# EAGLE design untitled (EAGLE 7.3.0)
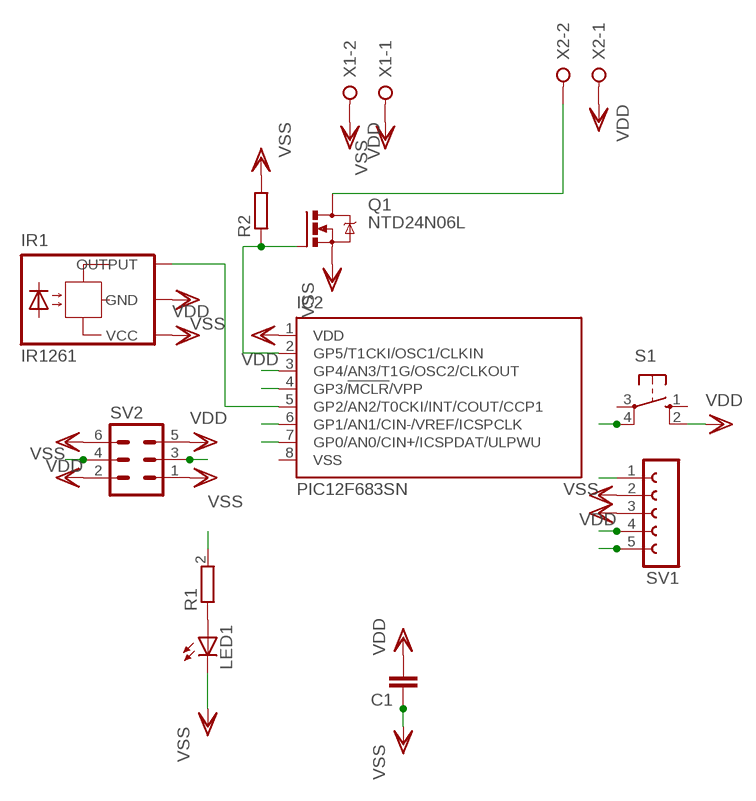
[diagram p0: schematic, sheet 1]

## Parts
C1  C-EUC0805  [C0805]
IC2  PIC12F683SN  [SO-08]
IR1  IR1261  [IR1261]
LED1  LEDCHIP-LED0603  [CHIP-LED0603]
Q1  NTD24N06L  [D-PAK_TO252AA]
R1  R0805_SMALL  [R0805_SMALL]
R2  R-EU_R0805  [R0805]
S1  10-XX  [B3F-10XX]
SV1  FE05-1  [FE05-1]
SV2  MA03-2  [MA03-2]
X1  W237-02P  [W237-132]
X2  W237-02P  [W237-132]

## Nets
MCLR: IC2.4(GP3/!MCLR!/VPP) SV1.1 SV2.4
N$1: IC2.5(GP2/AN2/T0CKI/INT/COUT/CCP1) IR1.VO(OUTPUT)
N$2: LED1.A R1.1(A)
N$3: IC2.2(GP5/T1CKI/OSC1/CLKIN) Q1.1(G) R2.1
N$5: Q1.4(D) X2.2
PGC: IC2.6(GP1/AN1/CIN-/VREF/ICSPCLK) R1.2(B) SV1.5
PGD: IC2.7(GP0/AN0/CIN+/ICSPDAT/ULPWU) SV1.4 SV2.3
S1: IC2.3(GP4/AN3/T1G/OSC2/CLKOUT) S1.4(P1)
VDD: C1.2 IC2.1(VDD) IR1.VCC S1.2(S1) SV1.2 SV2.5 SV2.6 X1.2 X2.1
VSS: C1.1 IR1.GND LED1.C Q1.3(S) R2.2 SV1.3 SV2.1 SV2.2 X1.1
Unconnected: S1.1(S) S1.3(P)

## Power pins joined to a net without a drawn wire
VSS: IC2.8(VSS)

## Library data of the parts
C1 = rcl:C-EU: CAPACITOR, European symbol
IC2 = microchip:PIC12F683: 8-Pin Flash-Based, 8-Bit CMOS Microcontrollers with nanoWatt Technology Source: http://ww1.microchip.com/downloads/en/DeviceDoc/41211D_.pdf; MF: MICROCHIP; MPN: PIC12F683-I/SN; OC_FARNELL: 9759042; OC_NEWARK: 61K3434
IR1 = manuel:IR1261
LED1 = led:LED: LED OSRAM: - CHIPLED LG R971, LG N971, LY N971, LG Q971, LY Q971, LO R971, LY R971 LH N974, LH R974 LS Q976, LO Q976, LY Q976 LO Q996 - Hyper CHIPLED LW Q18S LB Q993, LB Q99A, LB R99A - SideLED LS A670, LO A670, LY A670, LG A670, LP A670 LB A673, LV A673, LT A673, LW A673 LH A674 LY A675 LS A676, LA A676, LO A676, LY A676, LW A676 LS A679, LY A679, LG A679 - Hyper Micro SIDELED® LS Y876, LA Y876, LO Y876, LY Y876 LT Y87S - SmartLED LW L88C, LW L88S LB L89C, LB L89S, LG L890 LS L89K, LO L89K, LY L89K LS L896, LA L896, LO L896, LY L896 - TOPLED LS T670, LO T670, LY T670, LG T670, LP T670 LSG T670, LSP T670, LSY T670, LOP T670, LYG T670 LG T671, LOG T671, LSG T671 LB T673, LV T673, LT T673, LW T673 LH T674 LS T676, LA T676, LO T676, LY T676, LB T676, LH T676, LSB T676, LW T676 LB T67C, LV T67C, LT T67C, LS T67K, LO T67K, LY T67K, LW E67C LS E67B, LA E67B, LO E67B, LY E67B, LB E67C, LV E67C, LT E67C LW T67C LS T679, LY T679, LG T679 LS T770, LO T770, LY T770, LG T770, LP T770 LB T773, LV T773, LT T773, LW T773 LH T774 LS E675, LA E675, LY E675, LS T675 LS T776, LA T776, LO T776, LY T776, LB T776 LHGB T686 LT T68C, LB T68C - Hyper Mini TOPLED® LB M676 - Mini TOPLED Santana® LG M470 LS M47K, LO M47K, LY M47K Source: http://www.osram.convergy.de LUXEON: - LUMILED® LXK2-PW12-R00, LXK2-PW12-S00, LXK2-PW14-U00, LXK2-PW14-V00 LXK2-PM12-R00, LXK2-PM12-S00, LXK2-PM14-U00 LXK2-PE12-Q00, LXK2-PE12-R00, LXK2-PE12-S00, LXK2-PE14-T00, LXK2-PE14-U00 LXK2-PB12-K00, LXK2-PB12-L00, LXK2-PB12-M00, LXK2-PB14-N00, LXK2-PB14-P00, LXK2-PB14-Q00 LXK2-PR12-L00, LXK2-PR12-M00, LXK2-PR14-Q00, LXK2-PR14-R00 LXK2-PD12-Q00, LXK2-PD12-R00, LXK2-PD12-S00 LXK2-PH12-R00, LXK2-PH12-S00 LXK2-PL12-P00, LXK2-PL12-Q00, LXK2-PL12-R00 Source: www.luxeon.com KINGBRIGHT: KA-3528ASYC Source: www.kingbright.com
Q1 = manuel:NTD24N06L: N-Channel HEXFET® Power MOSFET Logic Level
R1 = manuel:R0805_SMALL
R2 = rcl:R-EU_: RESISTOR, European symbol
S1 = switch-omron:10-XX: OMRON SWITCH; MPN: B3F-1000; OC_FARNELL: 176432; OC_NEWARK: 36M3542
SV1 = con-lsta:FE05-1: FEMALE HEADER; OC_FARNELL: unknown; OC_NEWARK: unknown
SV2 = con-lstb:MA03-2: PIN HEADER; OC_FARNELL: unknown; OC_NEWARK: unknown
X1 X2 = con-wago-508:W237-02P: WAGO SREW CLAMP; OC_FARNELL: unknown; OC_NEWARK: unknown

## Board
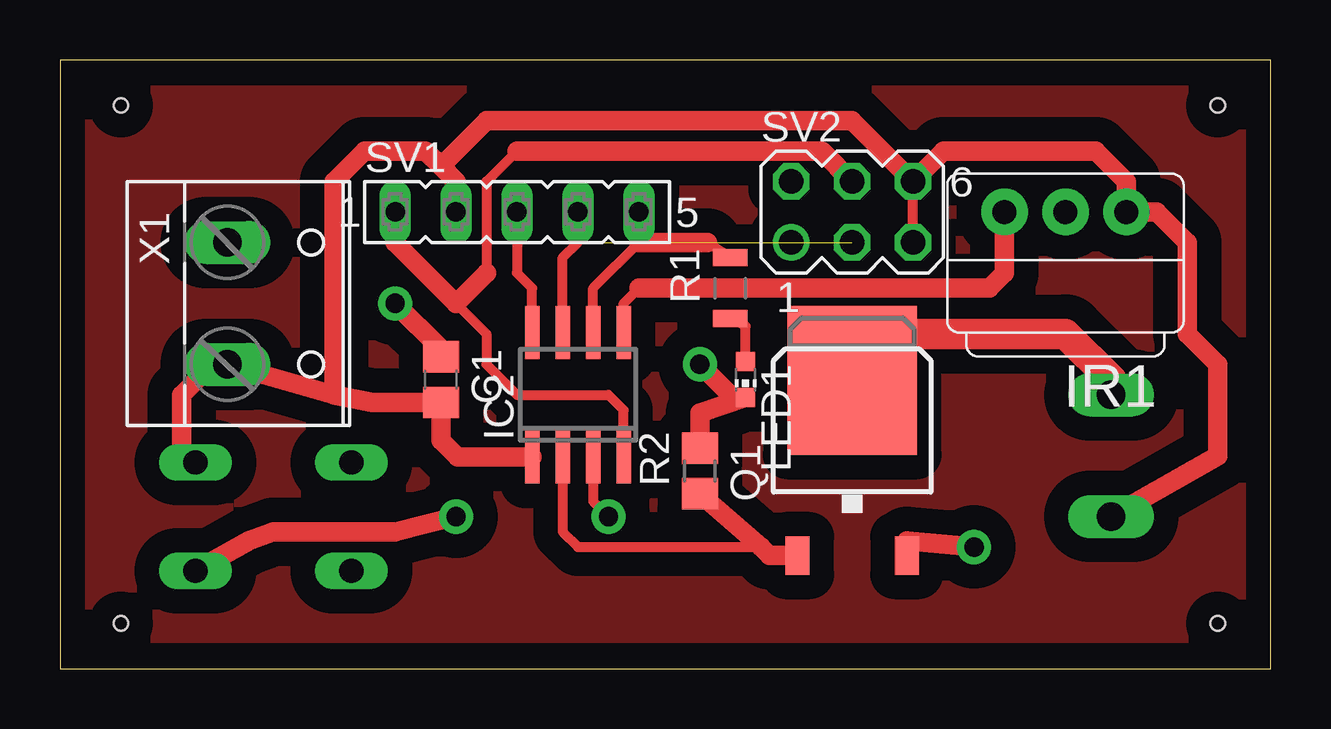
[diagram p1: board, top side]
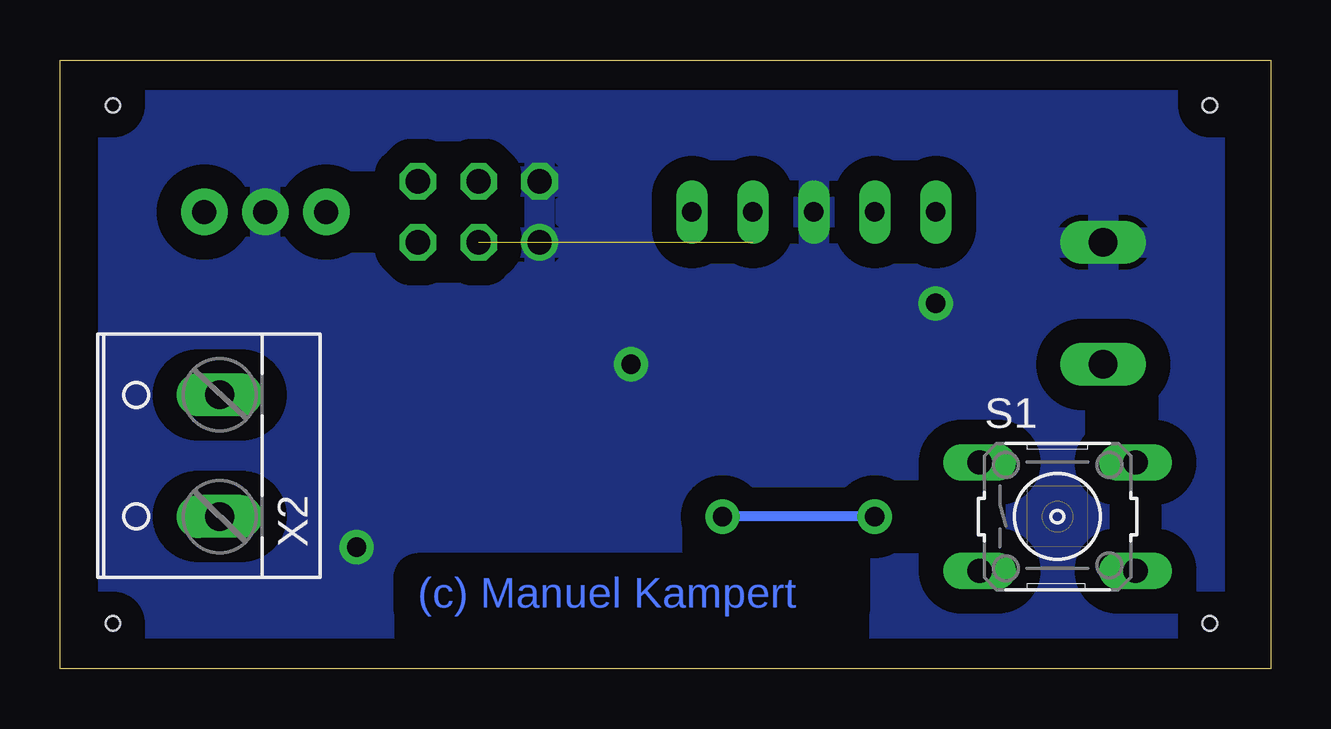
[diagram p2: board, bottom side, seen from below]

Size 50.47 x 25.39 mm. Coordinates in mm from the lower left corner, seen from the top.
Outline: 0,0 50.47,0 50.47,25.39 0,25.39 0,0
Copper layers (1*16): Top 0.035mm / dielectric 1.5mm / Bottom 0.035mm
Design rules "default": minimum track width 10mil, minimum drill 24mil, track to track 8mil, track to pad 8mil, pad to pad 8mil, via to via 8mil, smd to smd 8mil, copper to edge 40mil, drill to drill 8mil, minimum pad ring 10mil, minimum via ring 8mil, stop-mask expansion 4mil, vias tented up to drill 0mil, thermal gap 10mil
Holes 0.6 mm at 2.54,23.5 48.26,23.5 48.26,1.9 2.54,1.9

### Footprints (pad centres in the part's own frame; a part is rotated, then mirrored left to right if it is on the bottom)
C0805 = smd 1.3 x 1.5: 1 -0.95,0; 2 0.95,0
SO-08 = smd 0.6 x 2.2: 1 -1.905,-2.6; 2 -0.635,-2.6; 3 0.635,-2.6; 4 1.905,-2.6; 5 1.905,2.6; 6 0.635,2.6; 7 -0.635,2.6; 8 -1.905,2.6
IR1261 = drill 1 pad 1.93: GND 0,-1.27; VCC 0,-3.81; VO 0,1.27
CHIP-LED0603 = smd 0.8 x 0.8: A 0,-0.75; C 0,0.75
D-PAK_TO252AA = smd 1 x 1.6: 1 -2.28,-4.8; 3 2.28,-4.8 | smd 5.4 x 6.2: 4 0,2.5
R0805_SMALL = smd 0.711 x 1.422: 1 -1.27,0; 2 1.27,0
R0805 = smd 1.3 x 1.5: 1 -0.95,0; 2 0.95,0
B3F-10XX = drill 1.016 long: 1 -3.251,2.261; 2 3.251,2.261; 3 -3.251,-2.261; 4 3.251,-2.261
FE05-1 = drill 0.813 long: 1 -5.08,0; 2 -2.54,0; 3 0,0; 4 2.54,0; 5 5.08,0
MA03-2 = drill 1.016: 1 -2.54,-1.27 | drill 1.016 octagon: 2 -2.54,1.27; 3 0,-1.27; 4 0,1.27; 5 2.54,-1.27; 6 2.54,1.27
W237-132 = drill 1.194 long: 1 -2.54,-0.635; 2 2.54,-0.635

### Placement (x,y rotation side)
C1  15.88,12.06 270 top
IC2  21.59,11.43 0 top
IR1  40.64,19.05 90 top
LED1  28.57,12.06 180 top
Q1  33.02,9.53 0 top
R1  27.94,15.87 90 top
R2  26.67,8.25 90 top
S1  8.89,6.35 0 bottom
SV1  19.05,19.05 0 top
SV2  33.02,19.05 0 top
X1  7.62,15.24 270 top
X2  44.45,8.89 90 bottom

### Tracks (layer width: path | path; a pad name or v marks a point on that pad's centre or on a via)
MCLR
  Top 0.406: 16.51,15.24 17.78,13.97 17.78,12.7 19.05,11.43 22.86,11.43 23.5,10.79 IC2.4 | 19.05,21.59 17.78,20.32 17.78,16.51
  Top 0.813: SV1.1 13.97,17.78 16.51,15.24 17.78,16.51 | SV2.4 31.75,21.59 19.05,21.59
N$1
  Top 0.406: IC2.5 23.5,15.24 24.13,15.87
  Top 0.813: 24.13,15.87 38.73,15.87 39.37,16.51 IR1.VO
N$2
  Top 0.406: LED1.A 28.57,14.29 R1.1
N$3
  Top 0.406: IC2.2 20.95,5.71 21.59,5.08 29.21,5.08
  Top 0.813: Q1.1 29.57,4.72 29.21,5.08 R2.1
N$4
  pour Top (isolate 1.016): 2.54,24.13 49.53,24.13 49.53,1.27 1.27,1.27 1.27,24.13
N$5
  Top 1.27: Q1.4 34.29,12.7 35.56,13.97 41.91,13.97 43.81,12.06 X2.2
PGC
  Top 0.406: IC2.6 22.23,15.87 24.13,17.78 SV1.5 | 26.98,17.78 R1.2
  Top 0.813: 24.13,17.78 26.98,17.78
PGD  (1 unrouted)
  Top 0.406: IC2.7 20.95,17.14 21.59,17.78 SV1.4
S1  (via drill 0.8 pad 1.42)
  Top 0.406: IC2.3 22.23,6.98 v22.86,6.35
  Top 0.813: S1.4 7.9,5.36 8.89,5.71 13.97,5.71 v16.51,6.35
  Bottom 0.406: v16.51,6.35 v22.86,6.35
VDD
  Top 0.406: X1.2 6.35,12.7 | 5.08,9.17 S1.2 | SV1.2 16.51,20.32 | SV2.5 SV2.6
  Top 0.813: 6.35,12.7 5.08,11.43 5.08,9.17 | IC2.1 16.57,8.83 15.88,9.53 C1.2 13.02,11.12 11.43,11.43 | X1.2 11.43,11.43 | 16.51,20.32 15.88,20.96 | 15.88,20.96 15.24,21.59 12.7,21.59 11.43,20.32 11.43,11.43 | 15.88,20.96 17.78,22.86 33.02,22.86 SV2.6 36.83,21.59 43.18,21.59 44.45,20.32 IR1.VCC 45.72,19.05 46.99,17.78 46.99,13.97 48.26,12.7 48.26,8.89 X2.1
VSS  (via drill 0.8 pad 1.42)
  Top 0.406: IC2.8 19.68,15.87 19.05,16.51 SV1.3 | C1.1 15.88,13.33 | LED1.C 28.05,11.31
  Top 0.813: R2.2 26.67,10.68 LED1.C | 15.88,13.33 v13.97,15.24 | 28.05,11.31 v26.67,12.7 | Q1.3 35.3,5.34 v38.1,5.08
  pour Bottom (isolate 1.016): 2.54,1.9 2.54,23.5 48.26,23.5 48.26,1.9

### Text on the board
Bottom: (c) Manuel Kampert